# Altium schematic sheet stm32.SchDoc
size A4; SheetNumber: 4; SheetTotal: 4
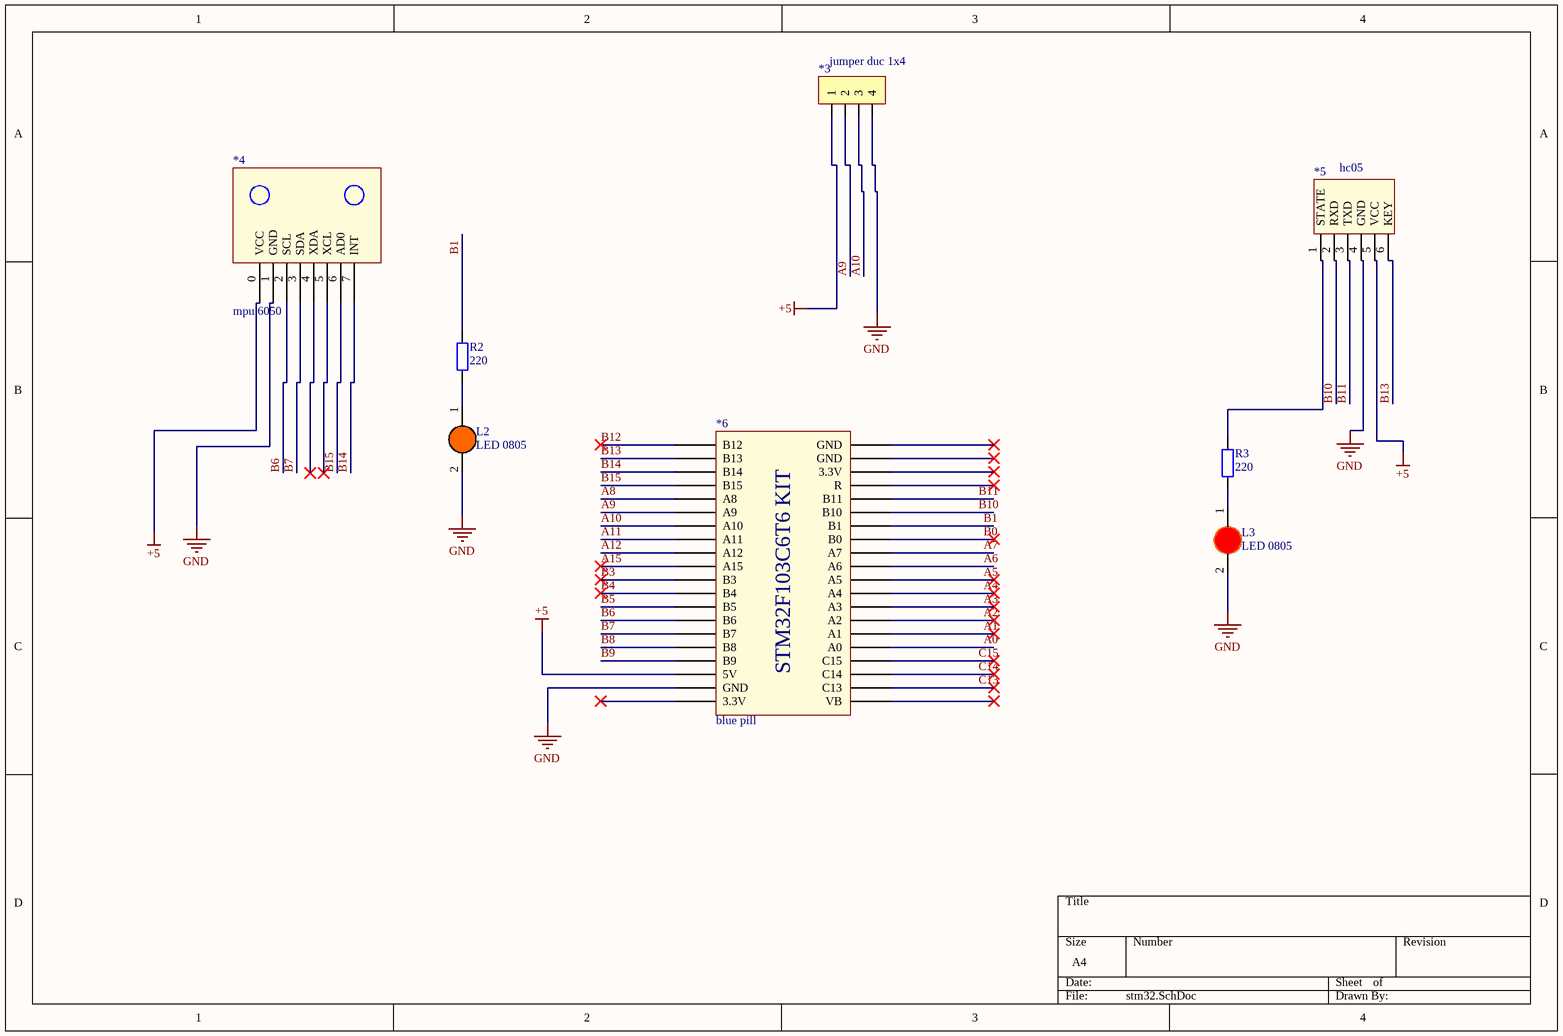
[diagram p0: stm32.SchDoc]

## Parts
*3  jumper duc 1x4  [jumper cai 1x4]
*4  mpu 6050  [MPU 6050]
*5  hc05  [HC05]
*6  blue pill  [blue pill]
L2  LED 0805  [LED-0805-Orange]
L3  LED 0805  [LED-0805-Red]
R2  220  [tro smd 0805]
R3  220  [tro smd 0805]

## Nets
+5: *3.1 *4.0(VCC) *5.5(VCC) *6.18(5V)
GND: *3.4 *4.1(GND) *5.4(GND) *6.19(GND) L2.2(K) L3.2(K)
A0: *6.25(A0)
A1: *6.26(A1)
A2: *6.27(A2)
A3: *6.28(A3)
A4: *6.29(A4)
A5: *6.30(A5)
A6: *6.31(A6)
A7: *6.32(A7)
A8: *6.5(A8)
A9: *3.2 *6.6(A9)
A10: *3.3 *6.7(A10)
A11: *6.8(A11)
A12: *6.9(A12)
A15: *6.10(A15)
B0: *6.33(B0)
B1: *6.34(B1) R2.2
B3: *6.11(B3)
B4: *6.12(B4)
B5: *6.13(B5)
B6: *4.2(SCL) *6.14(B6)
B7: *4.3(SDA) *6.15(B7)
B8: *6.16(B8)
B9: *6.17(B9)
B10: *5.2(RXD) *6.35(B10)
B11: *5.3(TXD) *6.36(B11)
B12: *6.1(B12)
B13: *5.6(KEY) *6.2(B13)
B14: *4.7(INT) *6.3(B14)
B15: *4.6(AD0) *6.4(B15)
C13: *6.22(C13)
C14: *6.23(C14)
C15: *6.24(C15)
Net*5_1: *5.1(STATE) R3.2
NetL2_1: L2.1(A) R2.1
NetL3_1: L3.1(A) R3.1

Not connected (* = marked no-connect by the designer): *4 4(XDA)* 5(XCL)*; *6 20(3.3V)* 21(VB)* 37(R)* 38(3.3V)* 39(GND)* 40(GND)*

## Notes on the sheet
- (in symbol blue pill) STM32F103C6T6 KIT

## Library data of the parts
L2 = LED 0805 Cam: Dán; Don_Vi: Con; Ma_Hang: MH002328; Ten_Linh_Kien: LED 0805 Màu Cam ( Orange); Ghi_Chu: *; Kieu_Chan: *; Chung_Loai: Dán
L3 = LED 0805 Do: Dán; Don_Vi: Con; Ma_Hang: MH000897; Ten_Linh_Kien: LED 0805 Màu Đỏ (Red); Ghi_Chu: *; Kieu_Chan: *; Chung_Loai: Dán
R2 R3 = Tro 0805 1% 1k: Dán; Don_Vi: Con; So_Chan: 2; Ten_Linh_Kien: Trở 0805 1% 1k; Ma_Hang: MH005468; Chung_Loai: Dán; Kieu_Chan: *